# Altium project MB1063.PrjPCB
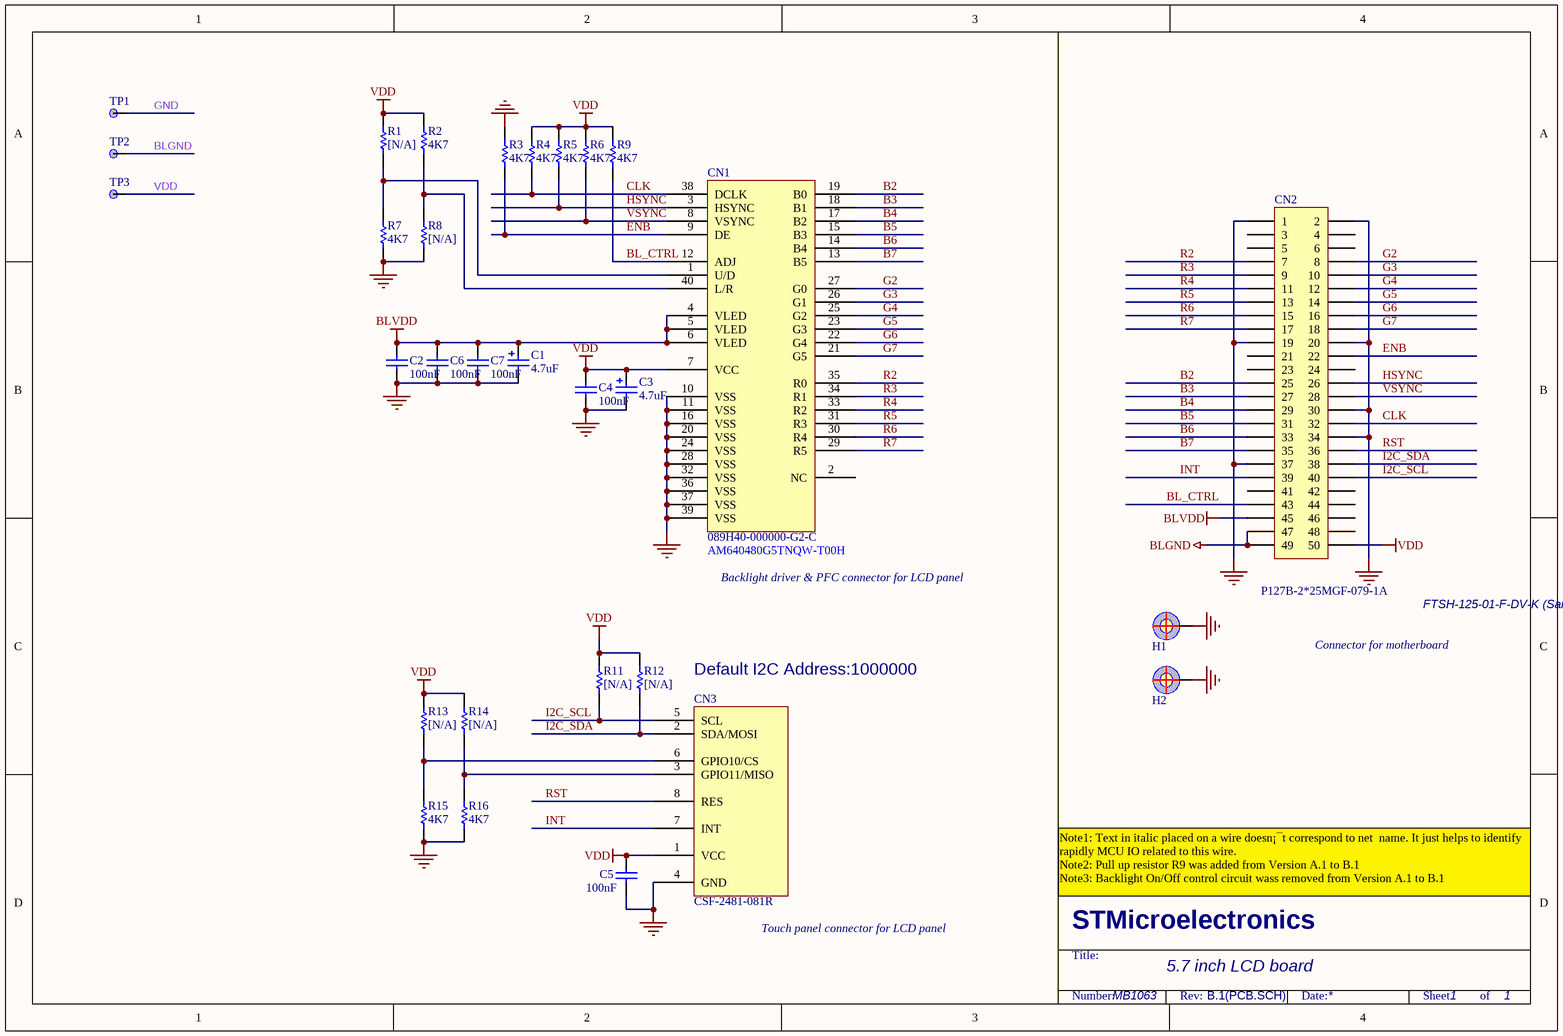
[diagram p0: MB1063.SchDoc]
1 sheet, 30 parts. Net scope: global (net labels, ports and power ports of the same name join across sheets).

## Sheet MB1063.SchDoc
size A4; Revision: B.1(PCB.SCH)

### Parts
C1  4.7uF  [TAN-A]
C2  100nF  [0603C]
C3  4.7uF  [TAN-A]
C4  100nF  [0603C]
C5  100nF  [0603C]
C6  100nF  [0603C]
C7  100nF  [0603C]
CN1  089H40-000000-G2-C  [FPC40_0R5_089H40LY-FPC_REV]
CN2  P127B-2*25MGF-079-1A  [FTSH-125-01-F-DV]
CN3  CSF-2481-081R  [FPC8_0R5_089H08_LY-FPC_REV]
H1  POSITION HOLE  [HOLE_C9D4R5]  (value not drawn)
H2  POSITION HOLE  [HOLE_C9D4R5]  (value not drawn)
R1  [N/A]  [0603R]
R2  4K7  [0603R]
R3  4K7  [0603R]
R4  4K7  [0603R]
R5  4K7  [0603R]
R6  4K7  [0603R]
R7  4K7  [0603R]
R8  [N/A]  [0603R]
R9  4K7  [0603R]
R11  [N/A]  [0603R]
R12  [N/A]  [0603R]
R13  [N/A]  [0603R]
R14  [N/A]  [0603R]
R15  4K7  [0603R]
R16  4K7  [0603R]
TP1  (no value)  [TP]
TP2  (no value)  [TP]
TP3  (no value)  [TP]

### Nets
BLGND: CN2.47 CN2.49 TP2.1
BLVDD: C1.1 C2.2 C6.2 C7.2 CN1.4(VLED) CN1.5(VLED) CN1.6(VLED) CN2.45
GND: C1.2 C2.1 C3.2 C4.1 C5.1 C6.1 C7.1 CN1.10(VSS) CN1.11(VSS) CN1.16(VSS) CN1.20(VSS) CN1.24(VSS) CN1.28(VSS) CN1.32(VSS) CN1.36(VSS) CN1.37(VSS) CN1.39(VSS) CN2.1 CN2.2 CN2.19 CN2.20 CN2.30 CN2.34 CN2.37 CN3.4(GND) H1.1 H2.1 R3.1 R7.2 R8.2 R15.2 R16.2 TP1.1
VDD: C3.1 C4.2 C5.2 CN1.7(VCC) CN2.50 CN3.1(VCC) R1.1 R2.1 R4.1 R5.1 R6.1 R9.1 R11.1 R12.1 R13.1 R14.1 TP3.1
B2: CN1.19(B0) CN2.25
B3: CN1.18(B1) CN2.27
B4: CN1.17(B2) CN2.29
B5: CN1.15(B3) CN2.31
B6: CN1.14(B4) CN2.33
B7: CN1.13(B5) CN2.35
BL_CTRL: CN1.12(ADJ) CN2.43 R9.2
CLK: CN1.38(DCLK) CN2.32 R4.2
ENB: CN1.9(DE) CN2.22 R3.2
G2: CN1.27(G0) CN2.8
G3: CN1.26(G1) CN2.10
G4: CN1.25(G2) CN2.12
G5: CN1.23(G3) CN2.14
G6: CN1.22(G4) CN2.16
G7: CN1.21(G5) CN2.18
HSYNC: CN1.3(HSYNC) CN2.26 R5.2
I2C_SCL: CN2.40 CN3.5(SCL) R11.2
I2C_SDA: CN2.38 CN3.2(SDA/MOSI) R12.2
INT: CN2.39 CN3.7(INT)
R2: CN1.35(R0) CN2.7
R3: CN1.34(R1) CN2.9
R4: CN1.33(R2) CN2.11
R5: CN1.31(R3) CN2.13
R6: CN1.30(R4) CN2.15
R7: CN1.29(R5) CN2.17
RST: CN2.36 CN3.8(RES)
VSYNC: CN1.8(VSYNC) CN2.28 R6.2
NetCN1_1: CN1.1(U/D) R1.2 R7.1
NetCN1_40: CN1.40(L/R) R2.2 R8.1
NetCN3_3: CN3.3(GPIO11/MISO) R14.2 R16.1
NetCN3_6: CN3.6(GPIO10/CS) R13.2 R15.1

Not connected (* = marked no-connect by the designer): CN1 2(NC); CN2 3 4 5 6 21 23 24 41 42 44 46 48

### Notes on the sheet
- (near CN1) AM640480G5TNQW-T00H
- Backlight driver & PFC connector for LCD panel
- Connector for motherboard
- FTSH-125-01-F-DV-K (Samtec)
- Default I2C Address:1000000
- Note1: Text in italic placed on a wire doesn¡¯t correspond to net  name. It just helps to identify rapidly MCU IO related to this wire.
  Note2: Pull up resistor R9 was added from Version A.1 to B.1
  Note3: Backlight On/Off control circuit wass removed from Version A.1 to B.1
- Touch panel connector for LCD panel
- 5.7 inch LCD board
- MB1063
- 1
- STMicroelectronics
- Title:
- Number:
- Rev:
- Date:
- Sheet          of

### Library data of the parts
C1 C3 = Cap Pol1: Polarized Capacitor (Radial); Value: 100pF; Published: 8-Jun-2000; Revision: July-2002: Re-released for DXP Platform.; Publisher: Altium Limited
C2 C4-C7 = CAP: Capacitor; Value: 100pF; Published: 8-Jun-2000; Revision: July-2002: Re-released for DXP Platform.; Publisher: Altium Limited
CN2 = Header 25X2: Header, 26-Pin, Dual row; Revision: 17-Jul-2002: Re-released for DXP Platform.; Publisher: Altium Limited
R1-R9 R11-R16 = Res1: Resistor; Value: 1K; Published: 8-Jun-2000; Revision: July-2002: Re-released for DXP Platform.; Publisher: Altium Limited
TP1-TP3 = TP